# Altium schematic sheet Display Module.SchDoc
size A
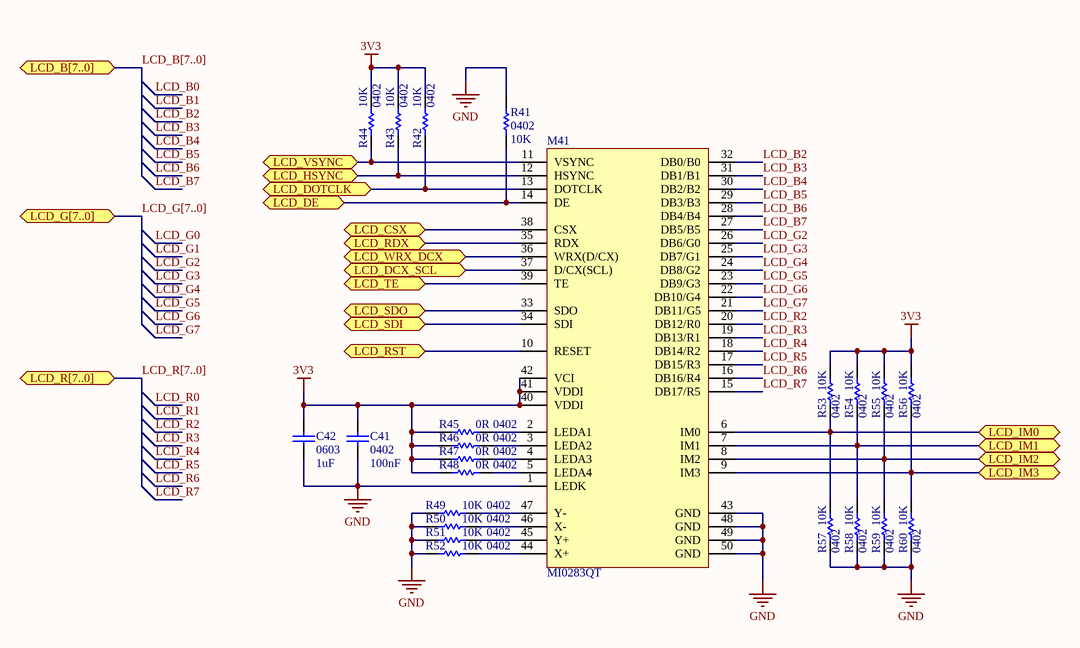
[diagram p0: Display Module.SchDoc]

## Parts
C41  0402  value 100nF  [CAPC1005X06N]
C42  0603  value 1uF  [CAPC1608X10N]
M41  MI0283QT  [2.8_SCREEN_MODULE_SKT]
R41  0402  value 10K  [RESC1005X04N]
R42  0402  value 10K  [RESC1005X04N]
R43  0402  value 10K  [RESC1005X04N]
R44  0402  value 10K  [RESC1005X04N]
R45  0402  value 0R  [RESC1005X04N]
R46  0402  value 0R  [RESC1005X04N]
R47  0402  value 0R  [RESC1005X04N]
R48  0402  value 0R  [RESC1005X04N]
R49  0402  value 10K  [RESC1005X04N]
R50  0402  value 10K  [RESC1005X04N]
R51  0402  value 10K  [RESC1005X04N]
R52  0402  value 10K  [RESC1005X04N]
R53  0402  value 10K  [RESC1005X04N]
R54  0402  value 10K  [RESC1005X04N]
R55  0402  value 10K  [RESC1005X04N]
R56  0402  value 10K  [RESC1005X04N]
R57  0402  value 10K  [RESC1005X04N]
R58  0402  value 10K  [RESC1005X04N]
R59  0402  value 10K  [RESC1005X04N]
R60  0402  value 10K  [RESC1005X04N]

## Ports
LCD_B[7..0] (bidir), LCD_CSX (bidir), LCD_DCX_SCL (bidir), LCD_DE (bidir), LCD_DOTCLK (bidir), LCD_G[7..0] (bidir), LCD_HSYNC (bidir), LCD_IM0 (bidir), LCD_IM1 (bidir), LCD_IM2 (bidir), LCD_IM3 (bidir), LCD_R[7..0] (bidir), LCD_RDX (bidir), LCD_RST (bidir), LCD_SDI (bidir), LCD_SDO (bidir), LCD_TE (bidir), LCD_VSYNC (bidir), LCD_WRX_DCX (bidir)

## Nets
3V3: C41.2 C42.2 M41.40(VDDI) M41.41(VDDI) M41.42(VCI) R42.1 R43.1 R44.1 R45.2 R46.2 R47.2 R48.2 R53.1 R54.1 R55.1 R56.1
GND: C41.1 C42.1 M41.1(LEDK) M41.43(GND) M41.48(GND) M41.49(GND) M41.50(GND) R41.1 R49.2 R50.2 R51.2 R52.2 R57.2 R58.2 R59.2 R60.2
LCD_B2: M41.32(DB0/B0)
LCD_B3: M41.31(DB1/B1)
LCD_B4: M41.30(DB2/B2)
LCD_B5: M41.29(DB3/B3)
LCD_B6: M41.28(DB4/B4)
LCD_B7: M41.27(DB5/B5)
LCD_CSX: M41.38(CSX) ; port LCD_CSX
LCD_DCX_SCL: M41.37(D/CX(SCL)) ; port LCD_DCX_SCL
LCD_DE: M41.14(DE) R41.2 ; port LCD_DE
LCD_DOTCLK: M41.13(DOTCLK) R42.2 ; port LCD_DOTCLK
LCD_G2: M41.26(DB6/G0)
LCD_G3: M41.25(DB7/G1)
LCD_G4: M41.24(DB8/G2)
LCD_G5: M41.23(DB9/G3)
LCD_G6: M41.22(DB10/G4)
LCD_G7: M41.21(DB11/G5)
LCD_HSYNC: M41.12(HSYNC) R43.2 ; port LCD_HSYNC
LCD_IM0: M41.6(IM0) R53.2 R57.1 ; port LCD_IM0
LCD_IM1: M41.7(IM1) R54.2 R58.1 ; port LCD_IM1
LCD_IM2: M41.8(IM2) R55.2 R59.1 ; port LCD_IM2
LCD_IM3: M41.9(IM3) R56.2 R60.1 ; port LCD_IM3
LCD_R2: M41.20(DB12/R0)
LCD_R3: M41.19(DB13/R1)
LCD_R4: M41.18(DB14/R2)
LCD_R5: M41.17(DB15/R3)
LCD_R6: M41.16(DB16/R4)
LCD_R7: M41.15(DB17/R5)
LCD_RDX: M41.35(RDX) ; port LCD_RDX
LCD_RST: M41.10(RESET) ; port LCD_RST
LCD_SDI: M41.34(SDI) ; port LCD_SDI
LCD_SDO: M41.33(SDO) ; port LCD_SDO
LCD_TE: M41.39(TE) ; port LCD_TE
LCD_VSYNC: M41.11(VSYNC) R44.2 ; port LCD_VSYNC
LCD_WRX_DCX: M41.36(WRX(D/CX)) ; port LCD_WRX_DCX
NetM41_2: M41.2(LEDA1) R45.1
NetM41_3: M41.3(LEDA2) R46.1
NetM41_4: M41.4(LEDA3) R47.1
NetM41_5: M41.5(LEDA4) R48.1
NetM41_44: M41.44(X+) R52.1
NetM41_45: M41.45(Y+) R51.1
NetM41_46: M41.46(X-) R50.1
NetM41_47: M41.47(Y-) R49.1

## Buses and harness runs
bus LCD_B[7..0] = port LCD_B[7..0]
bus LCD_G[7..0] = port LCD_G[7..0]
bus LCD_R[7..0] = port LCD_R[7..0]

## Library data of the parts
C41 C42 = Cap: Capacitor; Published: 8-Jun-2000; LatestRevisionDate: 17-Jul-2002; LatestRevisionNote: Re-released for DXP Platform.; PackageReference: RAD-0.3; Publisher: Altium Limited; PackageDescription: Radial Cap, Thru-Hole; 2 Leads; 0.3 in Pin Spacing
M41 = Screen Module
R41-R60 = Res1: Resistor; Published: 8-Jun-2000; LatestRevisionDate: 17-Jul-2002; LatestRevisionNote: Re-released for DXP Platform.; PackageReference: AXIAL-0.3; Publisher: Altium Limited; PackageDescription: Axial Device, Thru-Hole; 2 Leads; 0.3 in Pin Spacing